# Altium schematic sheet MCU_LDO.SchDoc
size A3; Organization: Altium Limited; Address1: L3, 12a Rodborough Rd; Address2: Frenchs Forest; Address3: NSW; Address4: Australia 2086
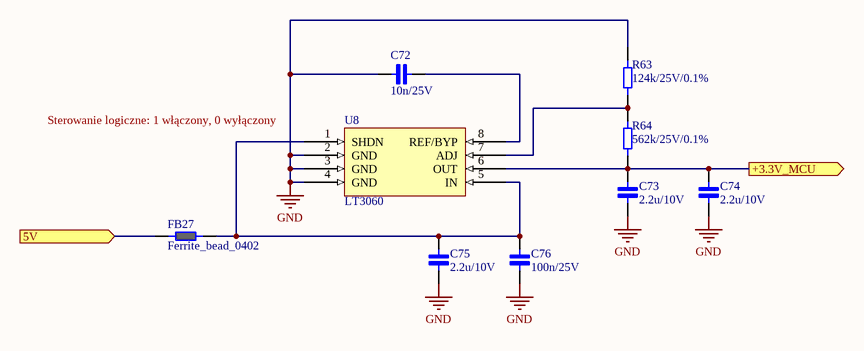
[diagram p0: MCU_LDO.SchDoc]

## Parts
C72  10n/25V  [Cap_0402]
C73  2.2u/10V  [Cap_0402]
C74  2.2u/10V  [Cap_0402]
C75  2.2u/10V  [Cap_0402]
C76  100n/25V  [Cap_0402]
FB27  Ferrite_bead_0402  [FERRITE_0402]
R63  124k/25V/0.1%  [RES_0402]
R64  562k/25V/0.1%  [RES_0402]
U8  LT3060  [TS8]

## Ports
5V (in), +3.3V_MCU (out)

## Nets
GND: C72.1 C73.1 C74.1 C75.1 C76.1 R63.2 U8.2(GND) U8.3(GND) U8.4(GND)
5V: FB27.1 ; port 5V
+3.3V_MCU: C73.2 C74.2 R64.1 U8.6(OUT) ; port +3.3V_MCU
NetC72_2: C72.2 U8.8(REF/BYP)
NetC75_2: C75.2 C76.2 FB27.2 U8.1(SHDN) U8.5(IN)
NetR63_1: R63.1 R64.2 U8.7(ADJ)

## Notes on the sheet
- (near U8) Sterowanie logiczne: 1 włączony, 0 wyłączony
- Title
- Size:
- Date:
- A3
- Number:
- Time:
- Revision:
- Sheet
- of
- File:

## Library data of the parts
C72 = Cap_0402_10n: Ceramic Capacitor 10n / 0402 / 25V / ±5%, Wurth Elektronik MLCC; ComponentLink1Description: New link; ComponentLink1URL: https://www.we-online.com/catalog/en/WCAP-CSGP-25VDC
C73-C75 = Cap_0402_2.2u: Ceramic Capacitor 2.2uF / 0402 / 10V / ±5%, Wurth Elektronik MLCC
C76 = Cap_0402_100n: Ceramic Capacitor 100n / 0402 / 25V / ±5%, Wurth Elektronik MLCC; ComponentLink1Description: New link; ComponentLink1URL: https://www.we-online.com/catalog/en/WCAP-CSGP-25VDC
FB27 = Ferrite_bead_0402: Ferrite bead, wurth 74269241102
R63 = Res_0402_124k: Vishay, thin film resistor 124k/25V/0.1%
R64 = Res_0402_562k: Vishay, thin film resistor 562k/25V/0.1%
U8 = Lt3060: 45V VIN, Micropower, / Low Noise, 100mA Low / Dropout, Linear Regulator